# EasyEDA Pro project 基于ESP32智能动植物养护调控系统_2026-06-21.epro, board PCB1
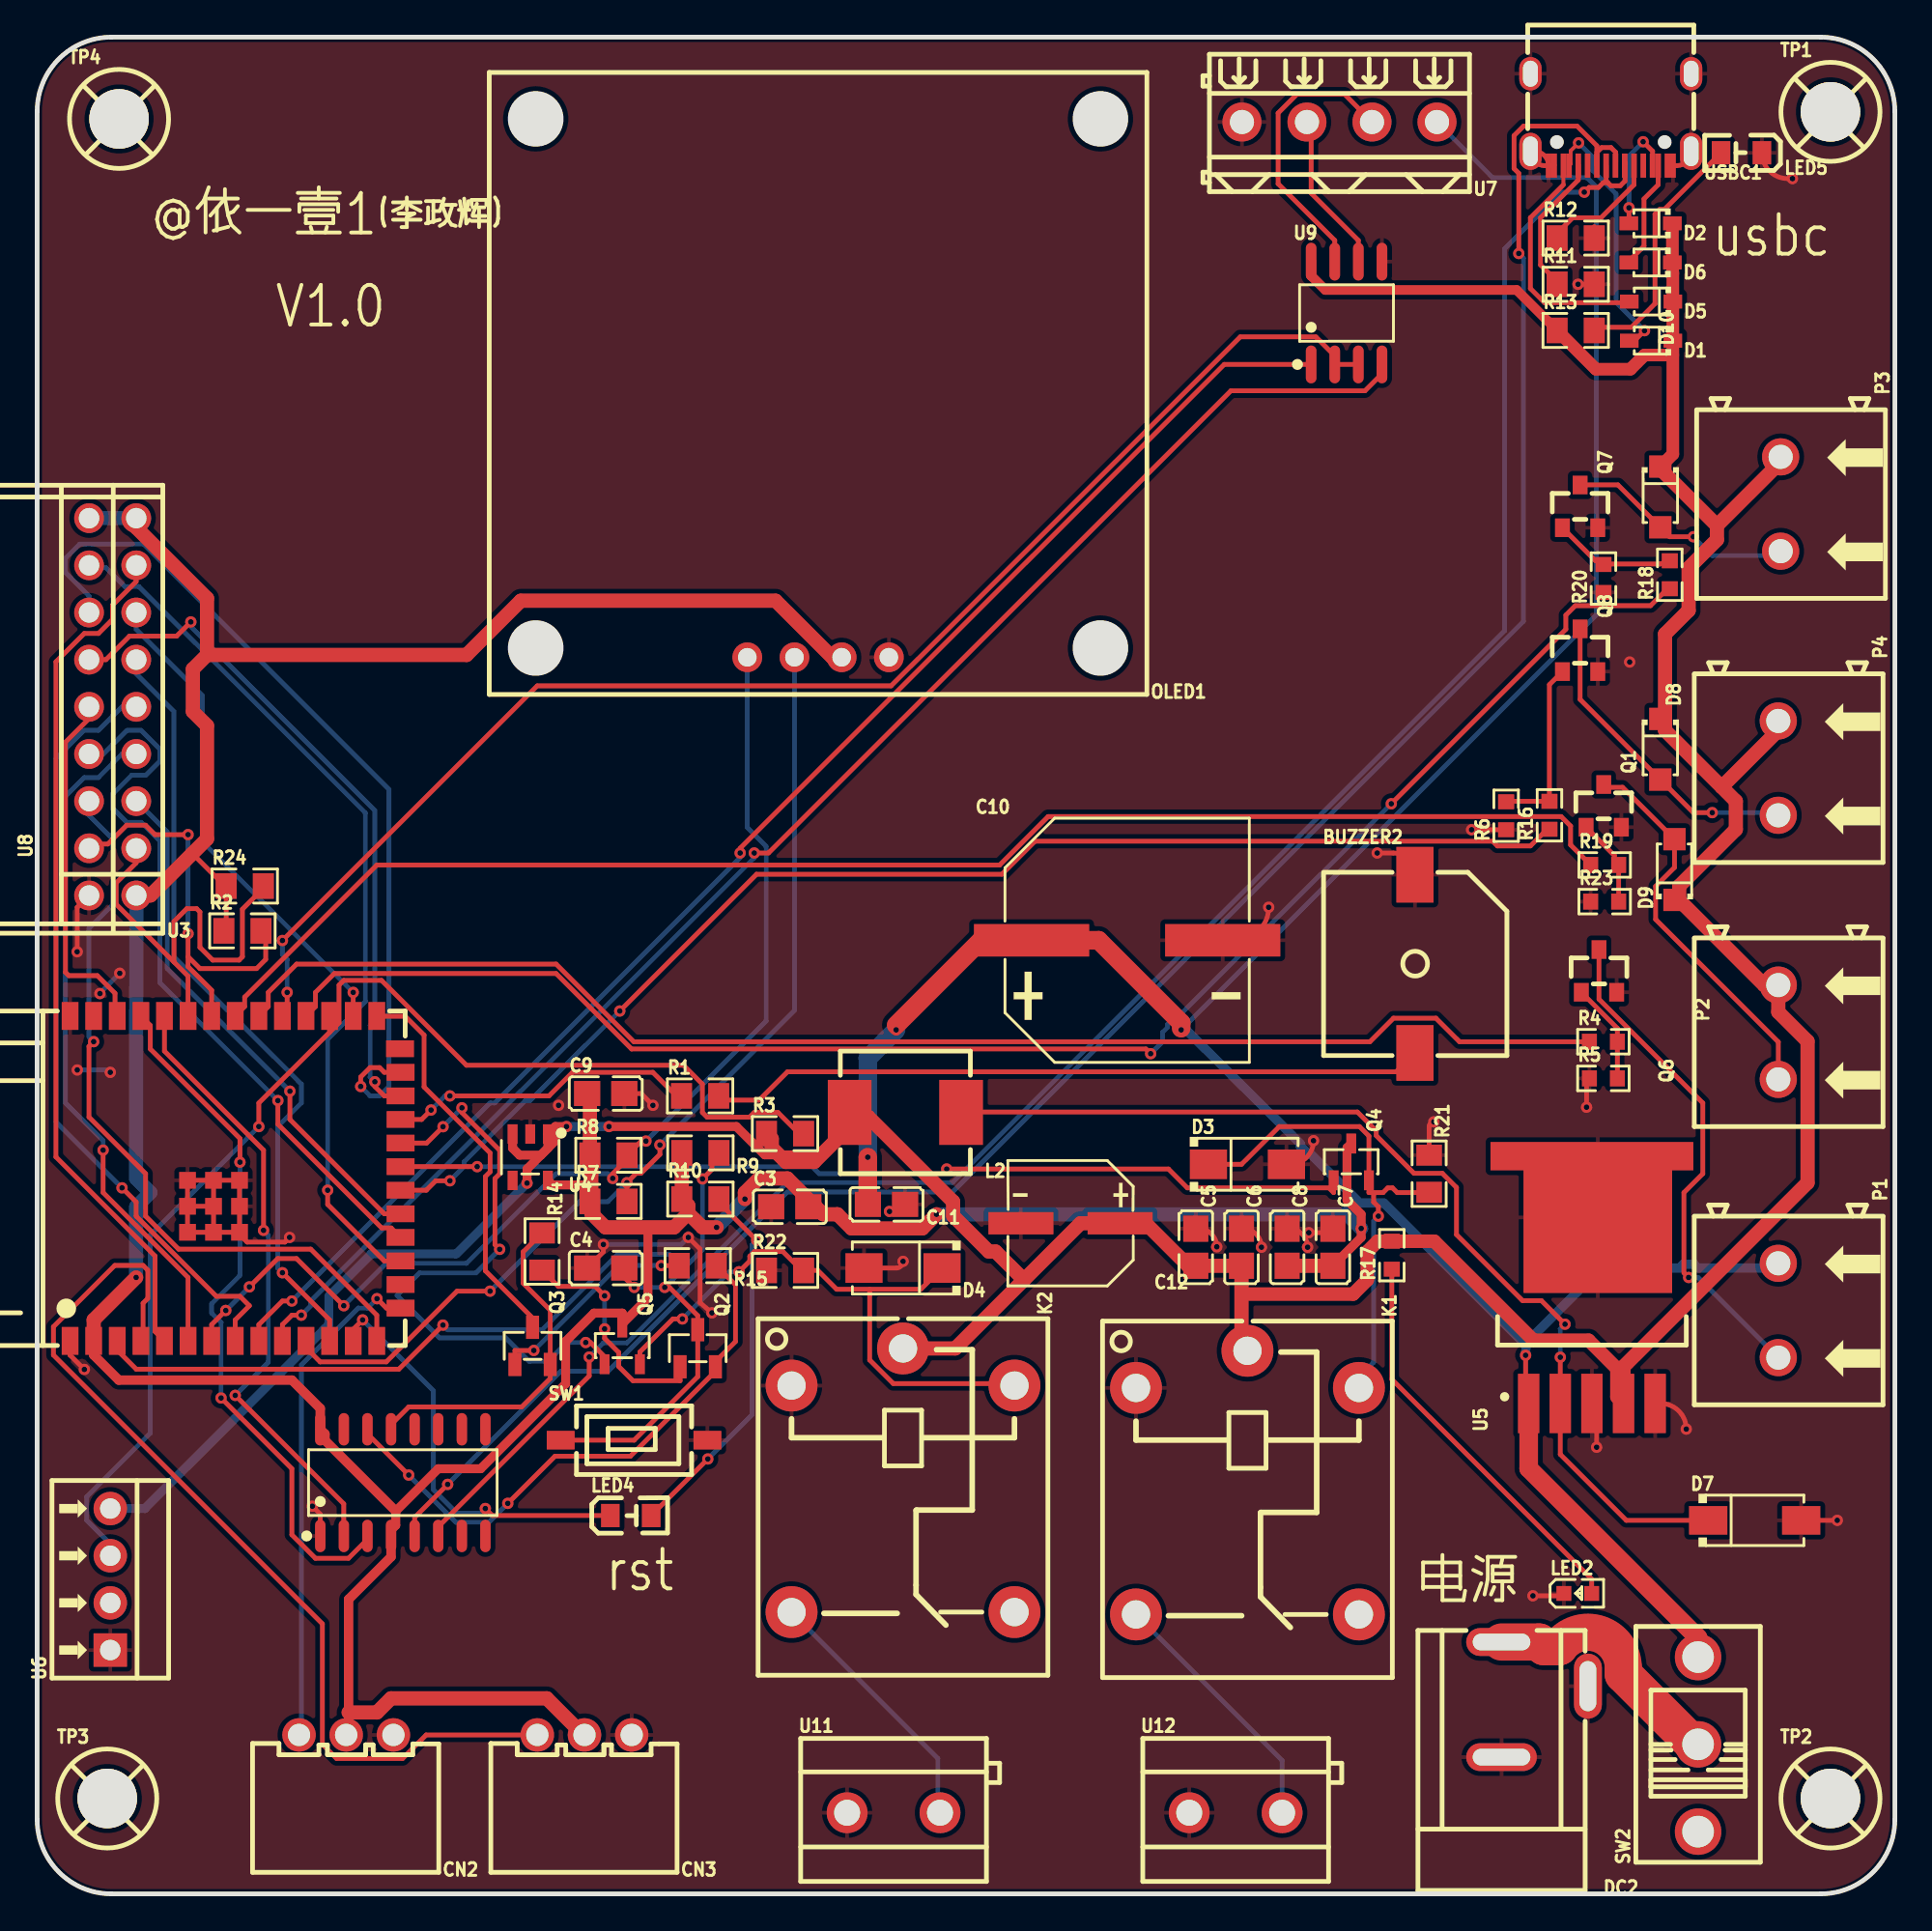
[diagram p1: board, top side]
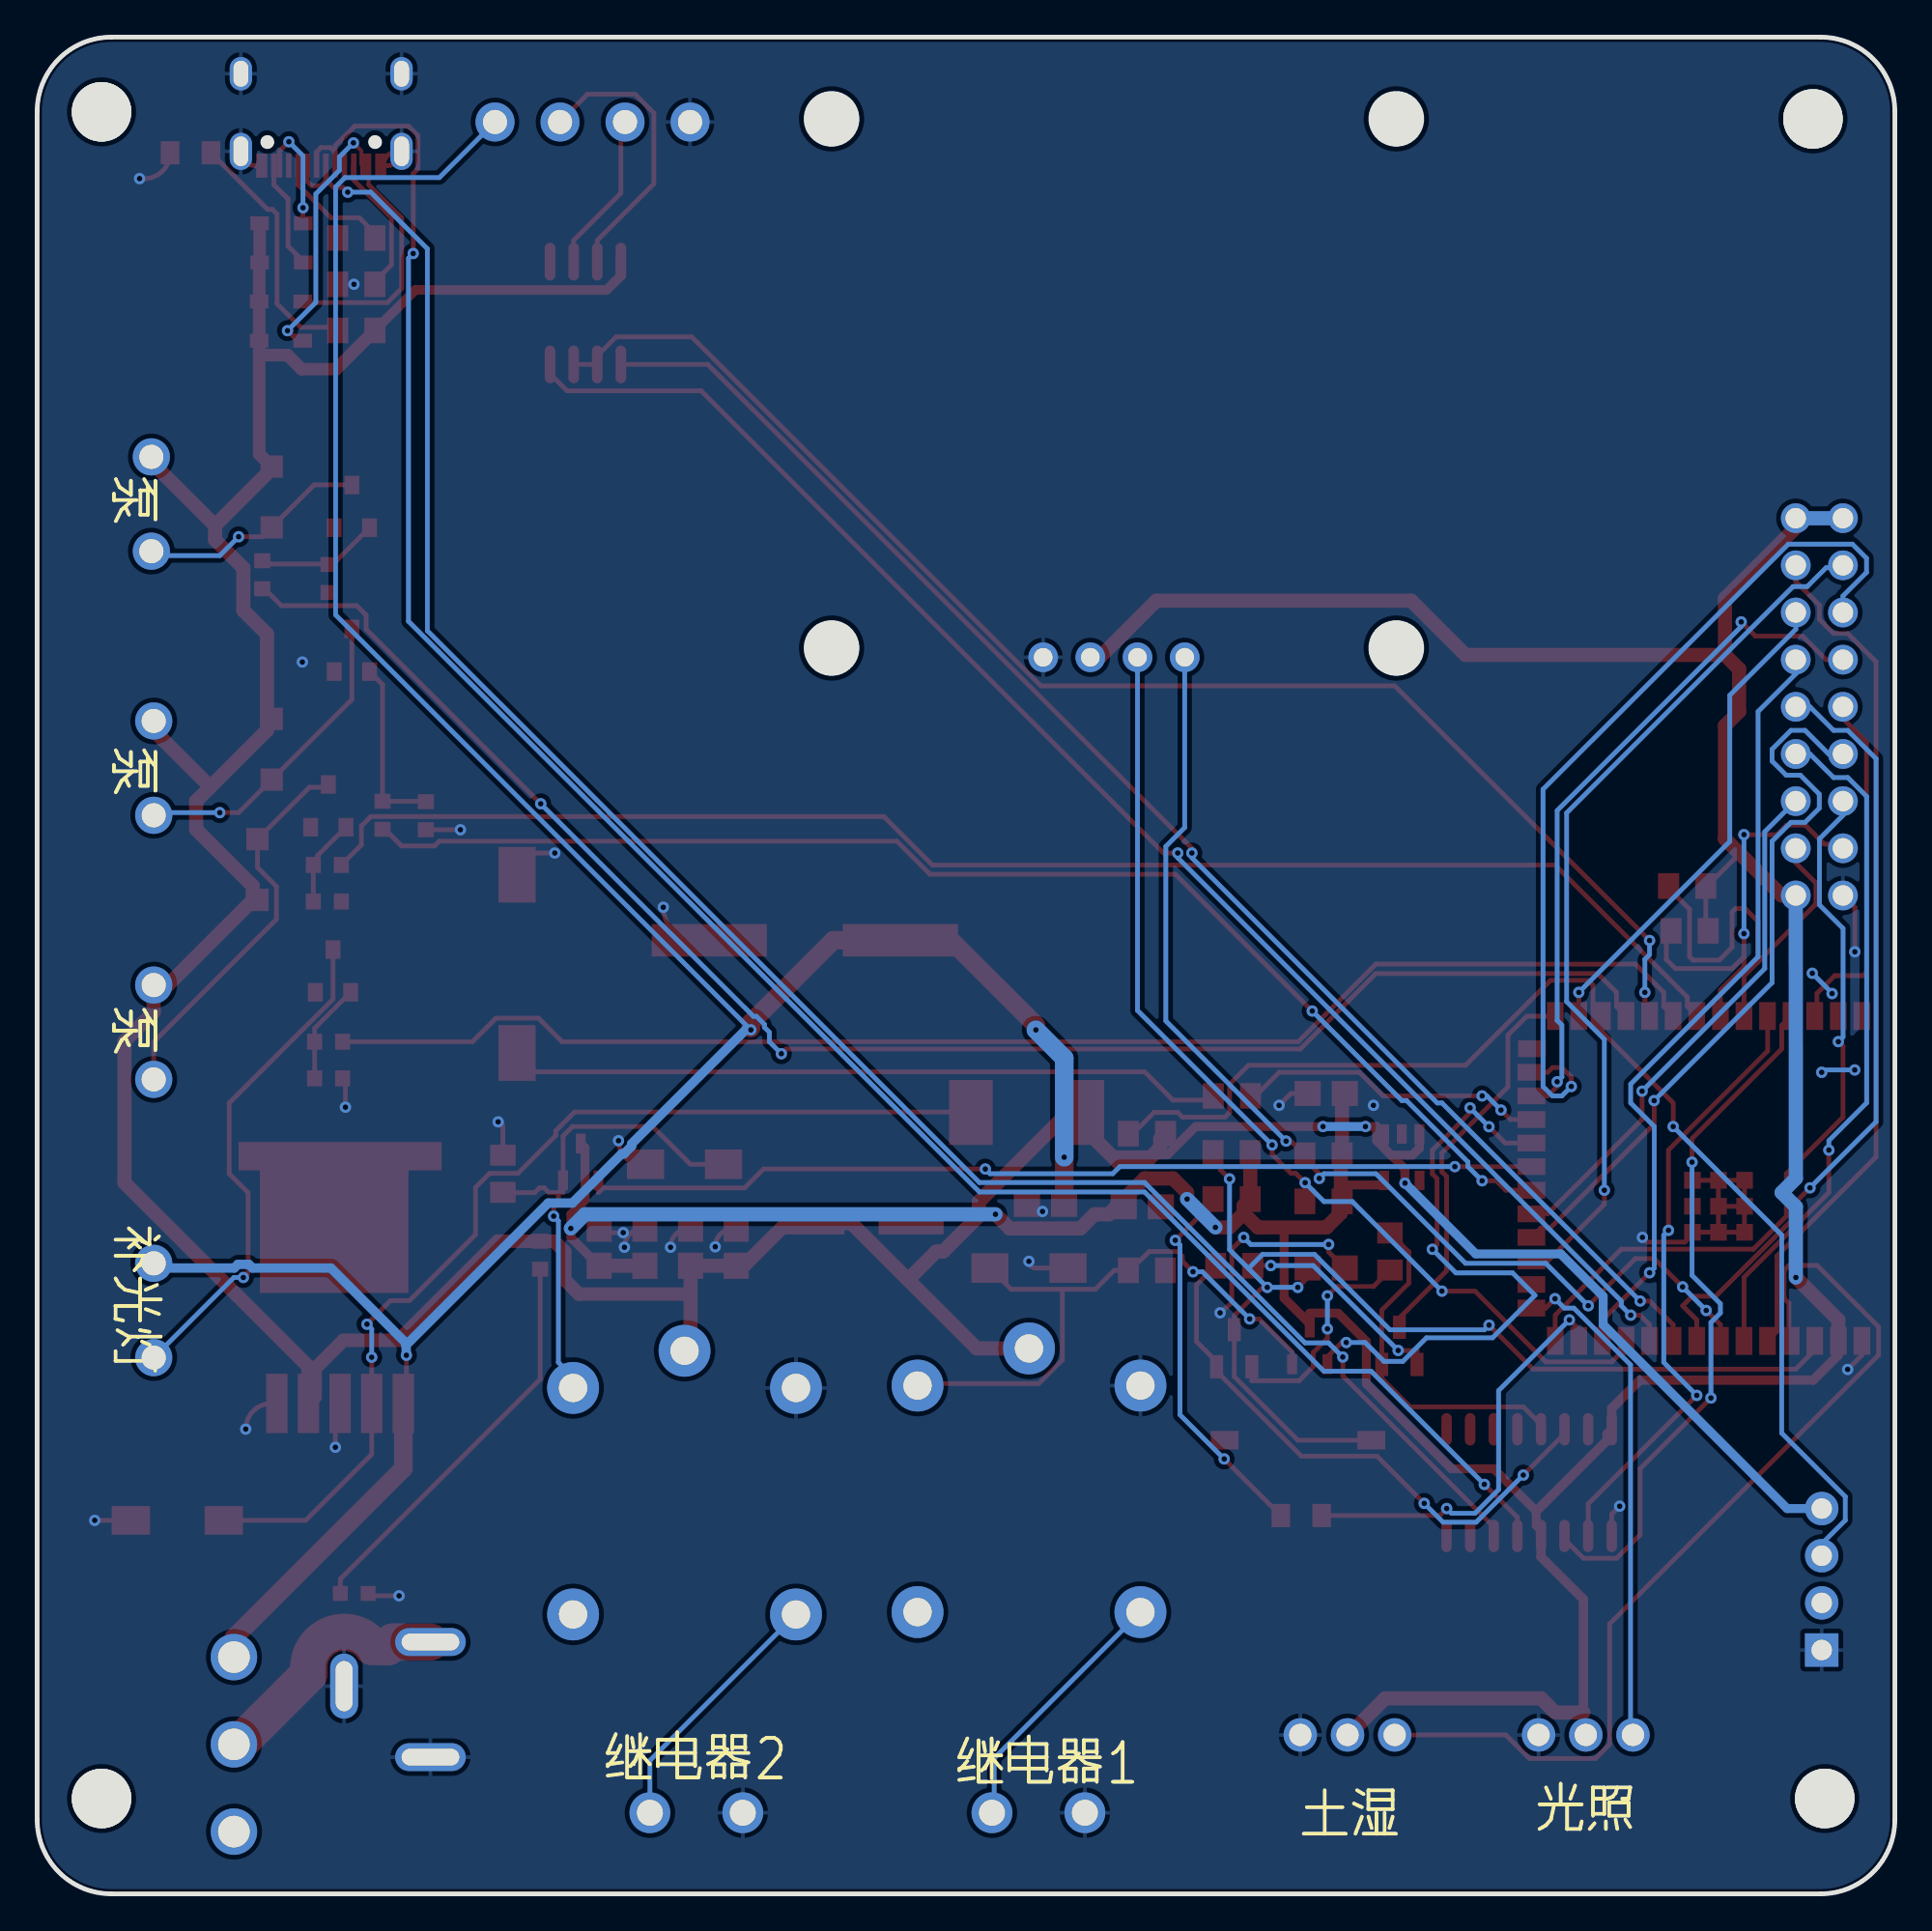
[diagram p2: board, bottom side, seen from below]

Outline 100 x 100 mm; copper layers: Top Layer, Bottom Layer. Coordinates in mm from the lower left corner of the outline.
Outline path: 0,96 0,4 arc(1.17,1.17) 4,0 96,0 arc(98.83,1.17) 100,4 100,96 arc(98.83,98.83) 96,100 4,100 arc(1.17,98.83) 0,96
Stack: Top Layer 0.035mm / Dielectric1 1.51mm FR4 er 4.5 / Bottom Layer 0.035mm

## Design rules (mm)
spacing copperThickness1oz (default): track to track 0.102, other pairs 0.152 to 0.3
spacing copperThickness2oz: track to track 0.203, other pairs 0.152 to 0.3
spacing Plane_innerPlane: track to track 0.102, other pairs 0.152 to 0.3
spacing Copper_copperRegion: track to track 0.102, other pairs 0.152 to 0.3
track width copperThickness1oz (default): min 0.127, default 0.254, max 2.54
track width POWER: min 0.203, default 0.762, max 2.54
differential pair differentialPair (default): width min 0.127, default 0.254, max 2.54; gap min 0.152, default 0.152
net GND uses copperRegion

## Placement (name value [footprint] x y rotation side)
BUZZER2  2.7kHz  [BUZ-SMD_GSD9605YB-3V2800]  74.17 50.09 0 top
C3  100nF  [C0805]  40.51 37.01 0 top
C4  100nF  [C0805]  30.61 33.71 0 top
C5  10uF  [C0805]  62.37 34.83 270 top
C6  100nF  [C0805]  64.83 34.83 270 top
C7  10uF  [C0805]  69.75 34.83 270 top
C8  100nF  [C0805]  67.29 34.83 270 top
C9  100nF  [C0805]  30.61 43.1 0 top
C10  680uF  [CAP-SMD_BD12.5-L13.0-W13.0-FD]  58.67 51.36 0 top
C11  100nF  [C0805]  45.72 37.13 180 top
C12  220uF  [CAP-SMD_BD6.3-L6.6-W6.6-LS7.2-FD]  55.63 36.12 180 top
CN2  XH-3AW  [CONN-TH_3P-P2.54_HCTL_XH-3AW]  16.64 8.56 180 top
CN3  XH-3AW  [CONN-TH_3P-P2.54_HCTL_XH-3AW]  29.46 8.56 180 top
D1  1N5819WS  [SOD-323_L1.8-W1.3-LS2.5-RD]  86.88 83.65 180 top
D2  1N5819WS  [SOD-323_L1.8-W1.3-LS2.5-RD]  86.85 89.97 180 top
D3  1N4007  [SMA_L4.3-W2.5-LS5.0-RD]  65.15 39.29 0 top
D4  1N4007  [SMA_L4.3-W2.5-LS5.0-RD]  46.61 33.71 180 top
D5  1N5819WS  [SOD-323_L1.8-W1.3-LS2.5-RD]  86.88 85.76 180 top
D6  1N5819WS  [SOD-323_L1.8-W1.3-LS2.5-RD]  86.85 87.86 180 top
D7  SS54  [SMA_L4.4-W2.8-LS5.4-R-RD]  92.46 20.12 0 top
D8  1N4001W  [SOD-123FL_L2.7-W1.8-LS3.8-RD]  87.38 61.65 270 top
D9  1N4001W  [SOD-123FL_L2.7-W1.8-LS3.8-RD]  88.14 55.17 90 top
D10  1N4001W  [SOD-123FL_L2.7-W1.8-LS3.8-RD]  87.38 75.23 270 top
DC2  DC-005A-20A  [DC-IN-TH_DC-005A-20A]  81.15 10.46 180 top
K1  SRD-03VDC-SL-C  [RELAY-TH_SRD-XXVDC-XL-C]  65.15 22.15 270 top
K2  SRD-03VDC-SL-C  [RELAY-TH_SRD-XXVDC-XL-C]  46.61 22.28 270 top
L2  33uH  [IND-SMD_L7.3-W6.8]  46.74 42.09 180 top
LED2  NCD0603Y2  [LED0603-RD]  82.93 16.18 0 top
LED4  -  [LED_0805]  32 20.37 0 top
LED5  -  [LED_0805]  91.69 93.78 180 top
OLED1  HS13L03W2C01  [OLED-TH_L35.4-W33.5_HS13L03W2C01]  42.04 66.6 180 top
P1  WJ500V-5.08-2P  [CONN-TH_2P-P5.00_WJ500V-5.08-2P]  93.73 31.42 270 top
P2  WJ500V-5.08-2P  [CONN-TH_2P-P5.00_WJ500V-5.08-2P]  93.73 46.41 270 top
P3  WJ500V-5.08-2P  [CONN-TH_2P-P5.00_WJ500V-5.08-2P]  93.85 74.85 270 top
P4  WJ500V-5.08-2P  [CONN-TH_2P-P5.00_WJ500V-5.08-2P]  93.73 60.63 270 top
Q1  AO3400  [SOT-23_L2.9-W1.3-P1.90-LS2.4-BR]  84.33 58.6 270 top
Q2  SS8050  [SOT-23-3_L2.9-W1.3-P1.90-LS2.4-BR]  35.56 29.39 270 top
Q3  SS8050  [SOT-23-3_L2.9-W1.3-P1.90-LS2.4-BR]  26.67 29.51 270 top
Q4  S8050  [SOT-23-3_L2.9-W1.3-P1.90-LS2.3-BR]  70.74 39.42 270 top
Q5  S8050  [SOT-23-3_L2.9-W1.3-P1.90-LS2.3-BR]  31.5 29.51 270 top
Q6  AO3400  [SOT-23_L2.9-W1.3-P1.90-LS2.4-BR]  84.07 49.71 270 top
Q7  AO3400  [SOT-23_L2.9-W1.3-P1.90-LS2.4-BR]  83.06 74.73 270 top
Q8  AO3400  [SOT-23_L2.9-W1.3-P1.90-LS2.4-BR]  83.06 66.98 270 top
R1  220Ω  [R0805]  35.69 42.98 0 top
R2  4.7kΩ  [R0805]  11.05 51.87 0 top
R3  4K7  [R0805]  40.26 40.94 0 top
R4  1kΩ  [R0603]  84.31 45.89 0 top
R5  10kΩ  [R0603]  84.31 43.92 0 top
R6  10kΩ  [R0603]  79.08 58.07 90 top
R7  4.7kΩ  [R0805]  30.75 37.29 0 top
R8  4.7kΩ  [R0805]  30.75 39.78 0 top
R9  10kΩ  [R0805]  35.7 39.91 180 top
R10  1kΩ  [R0805]  35.7 37.42 0 top
R11  5.1kΩ  [R0805]  82.82 86.69 0 top
R12  5.1kΩ  [R0805]  82.82 89.18 0 top
R13  1kΩ  [R0805]  82.82 84.2 0 top
R14  10kΩ  [R0805]  27.18 34.59 270 top
R15  10kΩ  [R0805]  35.56 33.83 180 top
R16  1kΩ  [R0603]  81.41 58.09 90 top
R17  10K  [R0603]  72.92 34.4 90 top
R18  1kΩ  [R0603]  87.88 71.04 90 top
R19  1kΩ  [R0603]  84.38 55.42 0 top
R20  10kΩ  [R0603]  84.31 70.84 90 top
R21  4.3K  [R0805]  74.93 38.79 270 top
R22  4.3K  [R0805]  40.26 33.58 0 top
R23  10kΩ  [R0603]  84.38 53.44 0 top
R24  4.7kΩ  [R0805]  11.18 54.28 0 top
SW1  -  [Key_SMD_3.6x6.1x2.5]  32.13 24.43 0 top
SW2  SS-12D10L3  [SW-TH_SS-12D10L3]  89.41 8.05 90 top
TP1  -  [M3螺丝]  96.6 95.91 0 top
TP2  -  [M3螺丝]  96.6 5.07 0 top
TP3  -  [M3螺丝]  3.84 5.07 0 top
TP4  -  [M3螺丝]  4.47 95.53 0 top
U1  2.4GHz  [WIRELM-SMD_ESP32-S3-WROOM-1]  10.67 38.53 90 top
U3  OV2640 Camera Board  [SENSORM-TH_L35.7-W3.9-OV2640]  4.06 63.93 180 top
U4  RT9080-33GJ5  [SOT-23-5_L3.0-W1.5-P0.95-LS2.8-BL]  26.54 39.67 180 top
U5  LM2596SX-5.0/NOPB  [TO-263-5_L10.2-W8.9-P1.70-TL]  83.69 31.42 90 top
U6  DB125-2.54-4P-GN-S  [CONN-TH_DB125-2.54-4P-GN]  3.94 16.94 90 top
U7  DB125-3.5-4P-GN-S  [CONN-TH_DB125-3.5-4P-GN]  70.1 95.43 180 top
U8  CH340C  [SOP-16_L10.0-W3.9-P1.27-LS6.0-BL]  19.69 22.15 0 top
U9  MAX485ESA(UMW)  [SOP-8_L5.0-W4.0-P1.27-LS6.0-BL]  70.49 85.14 0 top
U11  KF301-5.0-2P  [CONN-TH_P5.00_KF301-5.0-2P]  46.1 4.37 0 top
U12  KF301-5.0-2P  [CONN-TH_P5.00_KF301-5.0-2P]  64.52 4.37 0 top
USBC1  TYPE-C-31-M-12  [USB-C_SMD-TYPE-C-31-M-12]  84.71 95.55 180 top

## Footprints (pads in the part's own frame, mm; a bottom-side part is the same pattern mirrored in y, then rotated)
BUZ-SMD_GSD9605YB-3V2800
  rect 2x3 smd: 1(0,-4.8) 2(0,4.8)
C0805
  rect 1.41x1.35 smd: 1(-1,0) 2(1,0)
CAP-SMD_BD6.3-L6.6-W6.6-LS7.2-FD
  rect 3.5x1.2 smd: 1(-2.67,0) 2(2.67,0)
CAP-SMD_BD12.5-L13.0-W13.0-FD
  rect 6.2x1.75 smd: 1(-5.145,0) 2(5.145,0)
CONN-TH_2P-P5.00_WJ500V-5.08-2P
  round 2 hole 1.3: 1(-2.54,0) 2(2.54,0)
CONN-TH_3P-P2.54_HCTL_XH-3AW
  round 1.8 hole 1.199: 1(-2.54,0) 2(0.002,0) 3(2.54,0)
CONN-TH_DB125-2.54-4P-GN
  rect 1.8x1.8 hole 1.1: 1(-3.81,0)
  round 1.8 hole 1.1: 2(-1.27,0) 3(1.27,0) 4(3.81,0)
CONN-TH_DB125-3.5-4P-GN
  round 2.1 hole 1.3: 1(-5.25,0) 2(-1.75,0) 3(1.75,0) 4(5.25,0)
CONN-TH_P5.00_KF301-5.0-2P
  round 2.2 hole 1.4: 1(-2.5,0) 2(2.5,0)
DC-IN-TH_DC-005A-20A
  oval 3.8x1.5 hole 3.099x0.9: 1(2.325,-3.1) 2(2.325,3.1)
  oval 1.5x3.5 hole 0.9x2.7: 3(-2.325,-0.722)
IND-SMD_L7.3-W6.8
  rect 2.35x3.5 smd: 1(-3,0) 2(3,0)
Key_SMD_3.6x6.1x2.5
  rect 1.501x1.001 smd: 1(-3.95,0) 2(3.95,0)
LED0603-RD
  rect 0.8x0.8 smd: 1(-0.749,0) 2(0.749,0)
LED_0805
  rect 1x1.25 smd: 1(-1.15,0.005) 2(1.05,0.005)
M3螺丝
  round 3.2 hole 3.2: 1(-0.064,0.064)
OLED-TH_L35.4-W33.5_HS13L03W2C01
  round 1.6 hole 1: 1(-3.81,0) 2(-1.27,0) 3(1.27,0) 4(3.81,0)
R0603
  rect 0.806x0.864 smd: 1(-0.753,0) 2(0.753,0)
R0805
  rect 1.133x1.377 smd: 1(-1,0) 2(1,0)
RELAY-TH_SRD-XXVDC-XL-C
  round 2.794 hole 1.524: 1(-5.1,-6) 2(7.1,-6) 3(7.1,6) 4(-5.1,6) 5(-7.1,0)
SENSORM-TH_L35.7-W3.9-OV2640
  round 1.6 hole 1.1: 1(-1.27,10.16) 2(-1.27,7.62) 3(-1.27,5.08) 4(-1.27,2.54) 5(-1.27,0) 6(-1.27,-2.54) 7(-1.27,-5.08) 8(-1.27,-7.62) 9(-1.27,-10.16) 10(1.27,-10.16) 11(1.27,-7.62) 12(1.27,-5.08) 13(1.27,-2.54) 14(1.27,0) 15(1.27,2.54) 16(1.27,5.08) 17(1.27,7.62) 18(1.27,10.16)
SMA_L4.3-W2.5-LS5.0-RD
  rect 2x1.593 smd: 1(-2.1,0) 2(2.1,0)
SMA_L4.4-W2.8-LS5.4-R-RD
  rect 2.062x1.539 smd: 1(2.503,0) 2(-2.503,0)
SOD-123FL_L2.7-W1.8-LS3.8-RD
  rect 1.2x1.2 smd: 1(-1.635,0) 2(1.635,0)
SOD-323_L1.8-W1.3-LS2.5-RD
  rect 1x0.75 smd: 1(-1.173,0) 2(1.173,0)
SOP-8_L5.0-W4.0-P1.27-LS6.0-BL
  oval 0.574x2.035 smd: 1(-1.905,-2.768) 2(-0.635,-2.768) 3(0.635,-2.768) 4(1.905,-2.768) 5(1.905,2.768) 6(0.635,2.768) 7(-0.635,2.768) 8(-1.905,2.768)
SOP-16_L10.0-W3.9-P1.27-LS6.0-BL
  oval 0.56x1.745 smd: 1(-4.445,-2.873) 2(-3.175,-2.873) 3(-1.905,-2.873) 4(-0.635,-2.873) 5(0.635,-2.873) 6(1.905,-2.873) 7(3.175,-2.873) 8(4.445,-2.873) 9(4.445,2.873) 10(3.175,2.873) 11(1.905,2.873) 12(0.635,2.873) 13(-0.635,2.873) 14(-1.905,2.873) 15(-3.175,2.873) 16(-4.445,2.873)
SOT-23-3_L2.9-W1.3-P1.90-LS2.3-BR
  rect 1.07x0.532 smd: 1(0.99,-0.95) 2(0.99,0.95) 3(-0.99,0)
SOT-23-3_L2.9-W1.3-P1.90-LS2.4-BR
  rect 1.25x0.7 smd: 1(1,-0.95) 2(1,0.95) 3(-1,0)
SOT-23-5_L3.0-W1.5-P0.95-LS2.8-BL
  rect 0.532x1.045 smd: 1(-0.95,-1.25) 2(0,-1.25) 3(0.95,-1.25) 4(0.95,1.25) 5(-0.95,1.25)
SOT-23_L2.9-W1.3-P1.90-LS2.4-BR
  rect 1x0.8 smd: 1(1.15,-0.95) 2(1.15,0.95) 3(-1.15,0)
SW-TH_SS-12D10L3
  round 2.5 hole 1.7: 1(-4.7,0) 2(0,0) 3(4.7,0)
TO-263-5_L10.2-W8.9-P1.70-TL
  rect 3.2x1.15 smd: 1(-5.008,3.404) 2(-5.008,1.702) 3(-5.008,0) 4(-5.008,-1.702) 5(-5.008,-3.404)
  custom 8.128x10.922 smd: 6(5.008,-0.318)
USB-C_SMD-TYPE-C-31-M-12
  oval 1.2x2 hole 0.8x1.6: 0(-4.325,1.706) 1(4.325,1.706)
  oval 1.2x1.8 hole 0.8x1.4: 2(4.325,-2.474) 3(-4.325,-2.474)
  rect 0.3x1.3 smd: A1(-3.35,2.474) A4(-2.55,2.474) A5(-1.25,2.474) A6(-0.25,2.474) A7(0.25,2.474) A8(1.25,2.474) A9(2.55,2.474) A12(3.35,2.474) B1(3.05,2.474) B4(2.25,2.474) B5(1.75,2.474) B6(0.75,2.474) B7(-0.75,2.474) B8(-1.75,2.474) B9(-2.25,2.474) B12(-3.05,2.474)
WIRELM-SMD_ESP32-S3-WROOM-1
  rect 1.5x0.9 smd: 1(-8.75,8.895) 2(-8.75,7.625) 3(-8.75,6.355) 4(-8.75,5.085) 5(-8.75,3.815) 6(-8.75,2.545) 7(-8.75,1.275) 8(-8.75,0.005) 9(-8.75,-1.265) 10(-8.75,-2.535) 11(-8.75,-3.805) 12(-8.75,-5.075) 13(-8.75,-6.345) 14(-8.75,-7.615) 27(8.75,-7.615) 28(8.75,-6.345) 29(8.75,-5.075) 30(8.75,-3.805) 31(8.75,-2.535) 32(8.75,-1.265) 33(8.75,0.005) 34(8.75,1.275) 35(8.75,2.545) 36(8.75,3.815) 37(8.75,5.085) 38(8.75,6.355) 39(8.75,7.625) 40(8.75,8.895)
  rect 0.9x1.5 smd: 15(-6.985,-8.895) 16(-5.715,-8.895) 17(-4.445,-8.895) 18(-3.175,-8.895) 19(-1.905,-8.895) 20(-0.635,-8.895) 21(0.635,-8.895) 22(1.905,-8.895) 23(3.175,-8.895) 24(4.445,-8.895) 25(5.715,-8.895) 26(6.985,-8.865)
  rect 0.9x0.9 smd: 41(-2.9,2.575) 41(-2.9,1.175) 41(-2.9,-0.225) 41(-1.5,2.575) 41(-1.5,1.175) 41(-1.5,-0.225) 41(-0.1,2.575) 41(-0.1,1.175) 41(-0.1,-0.225)

## Nets
As in the schematic.

Pads without a net: K1 3; K2 3; SW2 1; TP1 1; TP2 1; TP3 1; TP4 1; U1 16 26 39; U4 4; U6 2; U8 7 8 9 10 11 12 15; USBC1 A8 B8

## Via types
v1: diameter 0.61, hole 0.305, Top Layer to Bottom Layer, 119 vias

## Routing (per net, layer and track width the routed paths; a pad name or vN(x,y) marks a point on that pad's centre or on a via; arc(x,y) is an arc through that point)
3V3: length 235.8
  Top Layer w0.254: R2.1 10.18,51.99 R24.1 10.1,54.28 8.35,56.03
  Top Layer w0.479: U4.5 27.74,38.18 29.83,38.18 ; 32.88,35.9 32.88,32.09 31.5,30.7 Q5.3 31.5,31.28 29.97,31.28 28.45,29.76 28.45,27.47 23.88,22.9 21.59,22.9 19.3,20.61 19.3,19.85 19.05,19.6 U8.4 ; Q4.3 70.51,40.18 70.51,37.36 71.27,36.6 71.27,35.35 C7.2
  Top Layer w0.504: 19.3,20.61 15.49,24.42 15.49,24.77 U8.16 15.24,26.15 13.72,27.67 4.39,27.67 3.04,29.02 U1.2 ; CN2.2 16.76,8.69 16.76,15.87 19.05,18.15 U8.4
  Top Layer w0.762: U3.1 6.1,53.77 9.14,56.82 9.14,62.92 8.38,63.68 8.38,65.96 9.14,66.73 ; v1(36.57,35.9) 35.81,35.9 35.05,36.66 ; U3.9 5.33,73.58 9.14,69.77 9.14,66.73 ; 35.05,36.66 35.05,37.07 R10.1 R9.2 ; 35.05,36.66 34.29,35.9 30.59,35.9 29.83,36.66 29.83,39.71 R8.1 29.76,42.83 29.61,42.98 C9.1 ; v1(5.33,33.2) 3.04,30.91 U1.2 ; C7.2 C8.2 ; v1(48.41,36.6) 47.65,35.84 43.84,35.84 43.08,36.6 42.32,36.6 41.91,37.01 ; 9.14,66.73 23.11,66.73 26.03,69.65 39.75,69.65 42.8,66.6 OLED1.2 ; 41.91,37.01 C3.2 ; 41.91,37.01 40.38,38.53 38.86,38.53 38.1,37.77 v1(38.1,37.42) ; CN3.2 29.4,8.56 27.43,10.53 19.05,10.53 18.29,9.77 16.76,9.77 ; 29.83,37.42 R7.1
  Bottom Layer w0.762: U3.1 5.33,38.53 6.09,37.77 5.33,37.01 v1(5.33,33.2) ; U3.9 2.79,74.09 ; v1(71.27,35.84) 70.51,36.6 v1(48.41,36.6) ; v1(38.1,37.42) v1(36.57,35.9)
5V: length 239.7
  Top Layer w0.479: v1(26.37,38.28) 26.37,39.04 27.89,40.56 27.89,41.33 ; 27.89,41.33 U4.1 27.49,40.16 27.12,39.79 25.97,39.79 25.59,40.16 U4.3 ; 27.89,41.33 v1(28.5,41.33) ; v1(30.78,41.33) 37.64,41.33 39.16,39.8 42.21,39.8 43.74,41.33
  Top Layer w0.516: U9.8 68.58,87.15 69.34,86.38 79.64,86.38 R13.1
  Top Layer w0.675: D10.1 88.05,77.54 D1.1 D5.1 88.05,87.28 D6.1 D2.1 ; 88.05,82.88 86.53,82.88 85.76,82.11 83.91,82.11 R13.1
  Top Layer w0.726: 64.83,32.3 70.84,32.3 71.6,33.07 71.6,34.59 72.16,35.15 R17.2 75.21,35.15 80.54,29.82 83.52,29.82 85.04,28.29 85.04,26.77 U5.4
  Top Layer w0.762: 88.39,53.52 92.96,48.95 P2.1 93.73,47.49 95.3,45.92 95.3,38.3 85.4,28.39 U5.4 ; 88.39,53.52 D9.1 ; 88.39,53.52 88.39,54.28 91.44,57.33 91.44,58.85 87.63,62.66 87.63,63.03 ; 87.63,63.03 D8.1 ; 87.63,63.03 87.63,67.85 88.9,69.12 88.9,71.41 90.42,72.93 90.42,73.69 ; R3.1 39.55,40.66 39.55,40.18 40.31,39.42 41.83,39.42 43.74,41.33 L2.2 43.97,41.85 44.74,41.85 49.31,37.28 49.31,36.52 51.23,34.59 51.59,34.59 53.12,33.07 ; P4.1 93.73,62.66 90.68,59.61 ; K2.5 49.42,29.38 56.16,36.12 C12.1 59.66,36.12 61.95,33.83 C5.2 C6.2 64.83,30.02 65.15,29.69 K1.5 ; 90.42,73.69 93.85,77.12 P3.1 ; 90.42,73.69 87.38,76.74 D10.1
  Bottom Layer w0.479: v1(26.37,38.28) 22.56,34.47 17.99,34.47 15.7,32.18 15.7,30.66 5.8,20.75 U6.4 ; v1(30.78,41.33) v1(28.5,41.33)
12V: length 156.7
  Top Layer w0.254: v1(46.24,46.53) 46.24,46.79 ; 80.29,26.56 80.12,26.72 v1(80.12,29.01)
  Top Layer w1: 61.58,46.62 61.58,46.91 57.14,51.36 50.81,51.36 46.24,46.79 ; C11.2 44.71,37.39 v1(44.71,39.67) ; SW2.3 89.41,13.79 80.29,22.91 U5.1
  Bottom Layer w0.254: v1(61.58,46.53) 83.93,68.88 83.93,91.93 83.43,92.44 78.35,92.44 U7.1 ; 80.12,29.51 v1(80.12,29.01)
  Bottom Layer w0.5: 80.14,29.55 72.49,37.21 71.19,37.21 68.54,39.86 68.41,39.86 68,40.27 68,40.39 61.86,46.53 v1(61.58,46.53) ; 80.14,29.55 80.14,29.66 84.19,33.71 88.41,33.71 88.61,33.91 89.19,33.91 89.39,33.71 93.33,33.71 93.62,33.97 P1.1 ; 80.14,29.55 80.14,29.53 ; 80.14,29.53 v1(80.12,29.01) ; 80.14,29.53 80.14,29.55
  Bottom Layer w1: v1(46.24,46.53) 44.71,45.01 v1(44.71,39.67)
GND: length 82.2
  Top Layer w0.254: U1.41 U1.41 U1.41 U1.41 ; U1.41 U1.41 ; U1.41 10.89,35.51 11.3,35.1 13.34,35.1 v1(13.59,35.36) ; D4.2 46.25,33.71 arc(46.51,33.81) v1(46.61,34.07) ; U1.1 1.77,29.01 v1(2.54,28.24) ; v1(83.95,24.05) 83.95,26.16 arc(83.87,26.34) U5.3 ; R6.1 v1(77.22,57.31) ; U5.5 87.39,26.41 arc(88.37,26.01) v1(88.77,25.03) ; v1(72.14,56.06) 73,56.06 arc(73.83,55.72) BUZZER2.2 ; C10.2 64.52,51.36 arc(65.77,51.88) v1(66.29,53.14) ; U1.41 U1.41 U1.41 ; U1.41 U1.41 U1.41 ; U1.41 U1.41 ; C4.1 30.48,34.58 v1(30.48,34.98) ; U1.41 U1.41 ; LED2.1 82.06,16.05 v1(80.52,16.05) ; v1(35.05,35.36) 35.69,34.72 35.69,31.84 v1(36.32,31.29) ; v1(94.49,92.38) 94.24,92.38 arc(93.25,92.79) LED5.1 ; U8.1 15.24,20.45 v1(14.81,20.88) ; U1.41 U1.41 ; v1(68.45,35.61) 69.53,35.61 arc(69.68,35.67) C7.1 ; C9.2 32.51,43.1 v1(33.15,42.47) ; 2.79,53.77 2.15,53.13 v1(2.15,50.74) ; v1(96.9,20.12) D7.1 ; C8.1 67.39,35.83 arc(68.1,35.53) v1(68.39,34.83) ; C6.1 64.91,35.83 arc(65.61,35.53) v1(65.91,34.83) ; D3.2 67.44,39.29 arc(68.34,39.67) v1(68.71,40.56) ; R12.2 83.82,89.8 ; USBC1.B1 USBC1.A12 ; USBC1.A12 81.15,93.08 arc(80.61,93.31) USBC1.1 80.59,93.85 arc(81.13,93.62) USBC1.A12 ; v1(83.41,42.37) 83.41,43.77 arc(83.45,43.88) R5.1 ; v1(45.88,36.75) 46.34,36.75 C11.1 ; R21.1 74.93,41.33 arc(75,41.51) v1(75.18,41.58) ; v1(82.95,86.69) R11.2 ; USBC1.A1 88.27,93.08 arc(88.81,93.31) USBC1.0 ; C5.1 62.52,35.83 arc(63.21,35.54) v1(63.5,34.85)
  Bottom Layer w0.254: v1(4.45,49.58) 3.38,48.51 v1(3.38,48.49) ; v1(35.05,35.36) 34.67,34.98 v1(30.48,34.98) ; v1(3.94,44.25) 3.81,44.37 v1(2.16,44.37)
  vias: v1(28.07,42.47) v1(85.72,66.34)
CH340_RX: length 37.8
  Top Layer w0.254: v1(10.92,39.41) 10.92,40.68 6.09,45.5 6.09,46.77 U1.37 ; U8.3 17.78,19.09 16.76,18.07 14.98,18.07 13.71,19.34 13.71,22.9 v1(9.9,26.71)
  Bottom Layer w0.254: v1(10.92,39.41) 10.92,33.31 9.39,31.79 9.39,31.28 9.9,30.77 v1(9.9,26.71)
CH340_TX: length 33.5
  Top Layer w0.254: v1(10.66,26.85) 16.5,21 16.5,19.48 U8.2 ; U1.36 6.85,45.39 12.19,40.05 v1(12.19,35.74)
  Bottom Layer w0.254: v1(10.66,26.85) 12.44,28.62 12.44,35.48 v1(12.19,35.74)
DTR: length 18.7
  Top Layer w0.254: R14.1 26.16,34.58 26.16,32.89 27.62,31.43 Q3.2 27.62,27.76 26.08,26.23 20,26.23 19.05,25.28 U8.13
EN: length 60.3
  Top Layer w0.254: v1(21.84,30.63) 19.47,28.26 5.33,28.26 4.32,29.27 4.32,29.53 U1.3 ; SW1.1 32.14,24.43 35.56,27.86 Q2.3 35.56,31.14 34.04,32.66 v1(33.78,32.66) ; C4.2 31.63,33.43 31.63,33.17 v1(32.14,32.66) ; R9.1 36.58,39.78 36.58,39.52 36.32,39.27 36.32,39.01 v1(35.81,38.51)
  Bottom Layer w0.254: v1(21.84,30.63) 22.1,30.38 27.18,30.38 31.24,34.44 34.04,34.44 34.8,33.68 ; v1(32.14,32.66) v1(33.78,32.66) 35.81,34.7 v1(35.81,38.51)
HREF: length 40.9
  Top Layer w0.254: U1.14 18.28,31.17 14.73,34.72 7.62,34.72 5.84,36.5 5.84,38.79 2.79,41.83 2.79,45.64 v1(3.04,45.9)
  Bottom Layer w0.254: 2.79,58.85 2.79,58.6 2.79,58.09 4.06,56.82 4.06,53.26 2.79,51.99 2.79,46.15 v1(3.04,45.9)
IO0: length 21.3
  Top Layer w0.254: U1.27 18.54,47.27 19.81,47.27 20.83,46.25 20.83,43.46 24.38,39.9 24.38,38.89 24.13,38.63 24.13,33.55 26.67,31.01 Q3.3
IO2: length 19.2
  Top Layer w0.254: U1.38 4.19,47.4 4.19,48.5 3.24,49.45 1.7,49.45 1.52,49.63 1.52,62.03 2.79,63.3 2.79,63.93
IO3: length 27
  Top Layer w0.254: U1.15 18.8,31.55 v1(18.29,32.05)
  Bottom Layer w0.254: v1(18.29,32.05) 17.78,31.55 17.28,31.55 14.23,28.5 14.23,8.69 CN2.3
IO4: length 51.5
  Top Layer w0.254: U1.4 5.7,29.78 5.7,31.81 5.96,32.07 5.96,33.59 5.7,33.85 4.18,33.85 0.88,30.54 0.88,29.02 15.35,14.54 15.35,8.05 16.12,7.29 19.67,7.29 20.94,8.56 26.92,8.56
IO5: length 46.4
  Top Layer w0.254: U3.8 5.33,71.44 5.33,70.68 4.06,69.41 4.06,68.64 3.3,67.88 2.53,67.88 1.01,66.36 1.01,39.69 6.34,34.35 6.34,30.29 U1.5
IO8: length 42.1
  Top Layer w0.254: U1.12 15.74,30.91 v1(13.2,33.45)
  Bottom Layer w0.254: v1(13.2,33.45) 12.95,33.71 12.95,41.33 14.22,42.6 14.22,43.61 7.36,50.47 7.36,63.68 5.33,65.71 5.33,66.22 U3.6
IO9: length 47.5
  Top Layer w0.254: v1(15.64,37.9) 15.64,37.13 18.69,34.09 U1.17
  Bottom Layer w0.254: v1(15.64,37.9) 15.64,46.02 17.67,48.06 17.67,58.22 5.48,70.41 4.72,70.41 3.7,71.42 2.94,71.42 2.79,71.55
IO12: length 70.3
  Top Layer w0.254: U1.20 20.95,37.9 21.46,38.4 v1(22.22,38.4) ; R16.1 81.28,57.34 80.38,56.44 78.61,56.44 78.35,56.69 53.71,56.69 51.94,54.91 38.73,54.91 v1(31.36,47.55)
  Bottom Layer w0.254: v1(31.36,47.55) 26.54,42.72 26.28,42.72 22.98,39.42 22.98,39.17 v1(22.22,38.4)
IO13: length 51.7
  Top Layer w0.254: v1(23.69,39.17) U1.21 ; v1(48.96,39.04) 60.9,39.04 61.91,38.02 69.53,38.02 69.79,37.77 Q4.1
  Bottom Layer w0.254: v1(23.69,39.17) 41.72,39.17 42.1,38.79 48.71,38.79 v1(48.96,39.04)
IO14: length 33.1
  Top Layer w0.254: U1.22 20.97,40.44 v1(21.85,41.32) ; Q5.1 30.55,28.93 29.78,29.69 v1(29.53,29.69) ; v1(22.87,42.33) 22.87,42.08 24.9,40.05 24.9,38.78 24.64,38.52 24.64,34.97 v1(24.9,34.71)
  Bottom Layer w0.254: v1(22.87,42.33) v1(21.85,41.32) ; v1(24.9,34.71) 23.63,33.44 20.58,33.44 19.37,32.23 21.66,29.95 25.21,29.95 26.48,28.68 27.5,28.68 28.51,29.69 v1(29.53,29.69)
IO15: length 42.2
  Top Layer w0.254: v1(4.57,38.02) 5.33,37.26 5.33,36.5 9.65,32.18 10.92,32.18 11.42,31.67 10.66,30.91 U1.8
  Bottom Layer w0.254: U3.5 4.57,63.93 3.3,62.66 2.53,62.66 1.01,61.14 1.01,41.58 v1(4.57,38.02)
IO19: length 22.4
  Top Layer w0.254: LED4.1 24.5,20.38 v1(24.12,20.75) ; v1(17.52,30.91) 17.01,30.4 U1.13
  Bottom Layer w0.254: v1(24.12,20.75) 23.87,20.5 22.6,20.5 21.33,21.77 21.33,27.1 v1(17.52,30.91)
IO21: length 16.7
  Top Layer w0.254: v1(21.2,42.21) 20.69,41.71 U1.23 ; R1.1 34.41,42.98 33.14,44.25 28.82,44.25 27.55,42.98 v1(22.22,42.98)
  Bottom Layer w0.254: v1(21.2,42.21) 21.96,42.98 v1(22.22,42.98)
IO35: length 26.6
  Top Layer w0.254: U1.28 v1(17.01,48.55)
  Bottom Layer w0.254: U3.7 5.33,68.87 5.33,68.11 8.89,64.55 8.89,56.68 v1(17.01,48.55)
IO36: length 67.4
  Top Layer w0.254: 15.74,46.4 16.25,46.91 16.25,48.94 16.5,49.2 18.54,49.2 23.11,44.63 34.79,44.63 35.81,43.61 35.81,42.09 36.06,41.83 38.35,41.83 38.6,42.09 39.87,42.09 40.89,41.07 41.14,41.07 R3.2 ; 15.74,46.4 U1.29 ; 15.74,46.4 11.93,42.59 v1(11.93,41.32)
  Bottom Layer w0.254: v1(11.93,41.32) 6.09,35.48 6.09,24.81 2.67,21.39 2.67,20.12 3.94,18.85 U6.3
IO37: length 87.6
  Top Layer w0.254: v1(72.89,58.71) 82.29,68.11 82.29,68.87 82.8,69.38 86.85,69.38 87.69,70.22 ; U1.30 14.98,47.79 14.98,48.55 16,49.57 27.94,49.57 32,45.5 59.69,45.5 v1(59.94,45.25)
  Bottom Layer w0.254: v1(59.94,45.25) 60.58,45.89 60.58,46.4 60.85,46.67 60.85,46.83 61.28,47.26 61.44,47.26 v1(72.89,58.71)
IO38: length 76.5
  Top Layer w0.254: U1.31 13.46,47.54 v1(13.46,48.55) ; v1(13.2,51.35) 26.92,65.06 45.97,65.06 64.77,83.86 68.83,83.86 69.84,82.84 69.84,82.59 69.85,82.37 U9.3
  Bottom Layer w0.254: v1(13.2,51.35) 13.2,50.58 13.46,50.33 v1(13.46,48.55)
IO39: length 76
  Top Layer w0.254: U1.32 12.44,47.79 12.44,48.55 13.97,50.08 27.94,50.08 32.12,45.89 71.74,45.89 73.01,47.16 75.3,47.16 76.57,45.89 R4.1
IO40: length 79.4
  Top Layer w0.254: U1.33 11.17,47.79 11.17,48.3 18.28,55.41 51.81,55.41 54.42,58.02 82.04,58.02 82.55,57.51 82.55,56.5 R19.1
IO47: length 37.2
  Top Layer w0.254: U1.24 18.69,42.98 18.18,43.48 v1(18.18,43.74) ; v1(8.27,68.5) 7.51,67.74 4.97,67.74 3.7,66.47 2.79,66.47
  Bottom Layer w0.254: v1(18.18,43.74) 17.92,43.99 17.92,46.79 18.18,47.04 18.18,58.34 8.27,68.25 v1(8.27,68.5)
IO48: length 47.6
  Top Layer w0.254: U1.25 18.69,44.25 18.43,44.5 17.92,44.5 17.42,43.99 v1(17.42,43.48)
  Bottom Layer w0.254: v1(17.42,43.48) 17.92,42.98 18.43,42.98 18.94,43.48 18.94,59.49 5.73,72.69 2.29,72.69 1.52,71.93 1.52,71.17 2.79,69.9 2.79,69.01
PCLK: length 36.8
  Top Layer w0.254: U1.6 8.12,33.2 3.55,37.77 v1(3.55,40.06)
  Bottom Layer w0.254: U3.4 4.57,61.39 3.3,60.12 2.53,60.12 1.52,59.11 1.52,42.6 3.55,40.57 v1(3.55,40.06)
RTS: length 30.7
  Top Layer w0.254: v1(20,22.56) 17.78,24.78 U8.14 ; 36.56,28.19 31.94,23.57 27.87,23.57 v1(25.33,21.03) ; R15.1 37.59,32.8 37.59,29.74 36.51,28.66 Q2.2
  Bottom Layer w0.254: v1(25.33,21.03) 24.32,20.02 22.54,20.02 v1(20,22.56)
RXD2: length 79.2
  Top Layer w0.254: v1(37.84,56.06) 37.84,56.31 63.9,82.37 U9.1 ; U1.9 11.93,30.66 13.2,31.93 v1(13.71,31.93)
  Bottom Layer w0.254: v1(13.71,31.93) 24.38,42.6 24.63,42.6 37.84,55.8 v1(37.84,56.06)
SCL: length 55.1
  Top Layer w0.254: R7.2 31.75,37.54 v1(31.75,38.3) 32.25,38.81 32.51,38.81 33.52,39.83 v1(33.52,40.33) ; v1(24.38,32.46) 22.6,32.46 18.79,28.65 15.23,28.65 14.47,29.41 U1.11
  Bottom Layer w0.254: OLED1.3 40.77,47.58 v1(33.52,40.33) ; v1(24.38,32.46) 29.2,37.29 30.73,37.29 v1(31.75,38.3)
SDA: length 60.1
  Top Layer w0.254: v1(32.77,40.54) 32.52,40.54 R8.2 31.75,39.55 30.98,38.79 v1(30.98,38.53) ; v1(11.42,32.69) 12.95,34.21 13.97,34.21 v1(16.5,31.67) ; U1.7 9.39,30.66 v1(10.16,31.42)
  Bottom Layer w0.254: v1(32.77,40.54) 39.24,47.01 39.24,56.41 38.23,57.43 OLED1.4 ; v1(16.5,31.67) 18.79,33.96 23.11,33.96 27.94,38.79 30.73,38.79 v1(30.98,38.53) ; v1(10.16,31.42) v1(11.42,32.69)
SIOC: length 23.8
  Top Layer w0.254: R24.2 12.18,54.16 11.05,53.03 11.05,50.47 10.87,50.29 9.45,50.29 8.76,50.98 8.76,52.88 8.58,53.06 8.05,53.06 7.37,52.37 7.37,50.19 ; U3.2 5.33,56.03 5.33,55.52 4.25,54.45 4.25,53.3 8.12,49.43 U1.35
SIOD: length 22.5
  Top Layer w0.254: U1.34 9.39,48.67 8.12,49.94 8.12,50.47 ; v1(8.12,51.71) 8.12,50.47 ; 8.12,50.47 8.76,49.83 11.81,49.83 12.3,50.33 12.3,51.87 ; v1(8.12,57.05) 6.34,57.05 5.84,57.56 4.82,57.56 3.81,56.54 3.04,56.54 2.79,56.31
  Bottom Layer w0.254: v1(8.12,51.71) v1(8.12,57.05)
TXD2: length 82.1
  Top Layer w0.254: U1.10 13.2,30.66 13.71,31.17 v1(14.22,31.17) ; v1(38.6,56.06) 39.37,56.06 64.26,80.95 71.48,80.95 72.24,81.71 72.24,82.22 U9.4
  Bottom Layer w0.254: v1(38.6,56.06) 38.6,55.8 14.73,31.93 14.73,31.67 v1(14.22,31.17)
USB_D+: length 115.2
  Top Layer w0.254: USBC1.A6 84.97,93.29 84.97,93.8 84.72,94.05 84.21,94.05 83.96,93.8 ; 83.96,93.8 USBC1.B6 ; 83.96,93.8 83.96,94.15 82.9,95.21 80.01,95.21 79.5,94.7 79.5,92.92 79.76,92.67 v1(79.76,88.35) ; v1(22.1,22.05) 20.32,20.28 U8.5
  Bottom Layer w0.254: v1(22.1,22.05) 28.19,28.15 30.73,28.15 40.39,37.8 49.28,37.8 80.01,68.54 80.01,88.09 v1(79.76,88.35)
USB_D-: length 109.5
  Top Layer w0.254: v1(83.28,91.65) 83.54,91.9 84.04,91.9 84.3,92.16 84.55,92.16 84.46,92.25 ; 84.46,92.25 USBC1.A7 ; 84.46,92.25 84.71,92 85.22,92 85.47,92.25 85.47,93.27 USBC1.B7 ; U8.6 21.59,19.77 29.72,27.9 v1(29.72,28.91)
  Bottom Layer w0.254: v1(83.28,91.65) 82.04,91.65 78.99,88.6 78.99,68.03 49.28,38.31 40.39,38.31 31.75,29.67 30.48,29.67 v1(29.72,28.91)
VSYNK: length 28.6
  Top Layer w0.254: U1.19 18.69,36.63 13.61,41.71 v1(13.61,43.23)
  Bottom Layer w0.254: v1(13.61,43.23) 7,49.83 7,57.2 5.48,58.72 U3.3
XCLK: length 39.7
  Top Layer w0.254: v1(12.96,42.72) 12.96,41.45 18.55,35.86 19.06,35.86 U1.18
  Bottom Layer w0.254: v1(12.96,42.72) 6.61,49.07 6.61,56.69 5.59,57.71 4.83,57.71 4.07,58.47 4.07,59.23 5.09,60.25 5.85,60.25 6.61,61.01 6.61,61.65 5.59,62.66 4.83,62.66 3.56,61.39 2.79,61.39
$1N4222: length 12.4
  Top Layer w0.254: v1(30.55,30.43) 30.55,29.92 31.31,29.16 31.31,28.4 32.07,27.64 34.61,27.64 Q2.1 ; v1(30.55,32.21) 30.04,32.72 28.06,32.72 R14.2
  Bottom Layer w0.254: v1(30.55,30.43) v1(30.55,32.21)
$1N4223: length 11.5
  Top Layer w0.254: v1(33.59,33.84) 34.36,33.84 R15.2 ; Q3.1 25.72,29.27 v1(26.74,29.27)
  Bottom Layer w0.254: v1(26.74,29.27) 31.31,33.84 v1(33.59,33.84)
$1N4230: length 13.6
  Top Layer w0.254: 90.64,93.77 87.6,90.72 87.34,90.72 87.09,90.47 87.09,85.64 85.82,84.37 84.04,84.37 R13.2
$1N4298: length 7.6
  Top Layer w0.254: USBC1.B5 82.96,92.3 80.93,90.27 80.93,87.73 81.82,86.84 R11.1
$1N4299: length 6.5
  Top Layer w0.254: USBC1.A5 85.96,92.05 84.18,90.27 82.66,90.27 81.9,89.51 81.9,89.26 R12.1
$1N6304: length 20.2
  Top Layer w0.254: v1(38.73,35.2) 36.7,37.23 R10.2 ; LED4.2 v1(36.1,23.42)
  Bottom Layer w0.254: v1(38.73,35.2) 38.48,34.95 38.48,25.8 v1(36.1,23.42)
$1N16950: length 27.4
  Top Layer w0.254: D3.1 64.83,39.29 66.86,41.33 71.18,41.33 71.69,40.82 Q4.2 71.69,37.77 72.45,37.77 72.71,38.02 72.96,38.02 73.21,37.77 74.74,37.77 R21.2 ; v1(72.2,36.5) 72.2,37.01 71.94,37.26 71.94,37.77
  Bottom Layer w0.254: v1(72.2,36.5) 71.94,36.24 71.94,28.62 70.93,27.61 70.93,27.47 K1.4
$1N17190: length 32.8
  Top Layer w0.254: Q5.2 32.45,29.19 34.22,30.96 v1(34.73,30.96) ; 44.81,32.56 44.81,28.75 46.09,27.48 52.44,27.48 K2.4 ; v1(37.78,33.5) 38.36,34.09 38.36,34.34 38.62,34.59 40.14,34.59 41.16,33.58 R22.2 42.02,33.58 43.04,32.56 47.57,32.56 D4.1
  Bottom Layer w0.254: v1(37.78,33.5) 37.27,33.5 v1(34.73,30.96)
$1N17359: length 13.9
  Bottom Layer w0.254: K1.2 67.02,7.18 U12.2
$1N17369: length 14.2
  Bottom Layer w0.254: K2.2 48.48,7.3 48.48,4.76 48.74,4.51 U11.2
$1N17603: length 38.6
  Top Layer w0.254: R1.2 36.83,43 37.08,42.75 38.86,42.75 40.39,44.27 73.15,44.27 BUZZER2.1
$1N17605: length 6.2
  Top Layer w0.254: D2.2 85.69,90.05 v1(85.69,90.81) ; v1(86.45,94.37) 86.96,93.86 USBC1.B9
  Bottom Layer w0.254: v1(85.69,90.81) 85.69,93.6 v1(86.45,94.37)
$1N17607: length 14
  Top Layer w0.2: v1(82.97,94.3) 82.55,93.88 82.55,93.17 82.54,93.16
  Top Layer w0.254: v1(86.52,84.19) 85.98,83.65 85.7,83.65
  Bottom Layer w0.254: v1(86.52,84.19) 85,85.71 85,91.56 83.73,92.83 83.73,93.55 v1(82.97,94.3)
$1N17610: length 13
  Top Layer w0.2: 82.16,92.05 USBC1.A9
  Top Layer w0.254: 85.7,85.76 85.64,85.7 81.14,85.7 80.38,86.46 80.38,90.27 82.16,92.05
$1N17613: length 5.9
  Top Layer w0.254: USBC1.A4 87.26,92.05 86.5,91.29 86.5,88.75 85.68,87.93 D6.2
$1N17648: length 21.9
  Top Layer w0.254: LED2.2 83.68,16.95 72.92,27.71 R17.1
$1N17654: length 13.9
  Top Layer w2: SW2.2 89.16,8.05 85.38,11.83 85.38,12.19 arc(84.07,14) 81.94,13.31 81.11,13.31 80.85,13.56 DC2.1
$1N17672: length 55.4
  Top Layer w0.254: L2.1 49.99,42.11 71.07,42.11 72.09,41.09 72.09,40.84 74.12,38.81 75.64,38.81 76.4,38.05 76.4,35.51 79.96,31.95 80.97,31.95 v1(82.25,30.68) ; v1(81.99,28.9) U5.2 81.99,23.67 85.54,20.12 D7.2
  Bottom Layer w0.254: v1(81.99,28.9) 81.99,30.43 v1(82.25,30.68)
$1N17696: length 15.4
  Top Layer w0.254: 69.85,87.91 69.85,89.05 66.8,92.1 66.8,95.91 67.82,96.93 70.38,96.93 U7.2
$1N17697: length 8.7
  Top Layer w0.254: U9.6 71.12,89.05 68.58,91.59 68.58,95.15 U7.3
$1N17715: length 27.1
  Top Layer w0.254: Q6.3 84.07,48.18 89.66,42.6 89.66,38.79 88.65,37.77 88.65,33.45 v1(88.9,33.2)
  Bottom Layer w0.254: P1.2 89.41,33.2 v1(88.9,33.2)
$1N17721: length 5.4
  Top Layer w0.254: Q6.1 85.06,46.62 R4.2 R5.2
$1N17723: length 21.1
  Top Layer w0.254: Q1.3 84.58,59.6 85.34,59.6 D9.2 88.14,55.28 87.12,54.26 87.12,52.49 93.73,45.88 P2.2
$1N17724: length 12.5
  Top Layer w0.254: 83.06,75.88 83.31,75.89 85.09,75.89 D10.2 87.88,73.09 v1(89.15,73.09)
  Bottom Layer w0.254: P3.2 93.62,72.08 90.17,72.08 v1(89.15,73.09)
$1N17725: length 17.1
  Top Layer w0.254: v1(90.17,58.23) 89.15,58.23 D8.2 83.06,64.33 Q8.3
  Bottom Layer w0.254: P4.2 93.62,58.09 93.47,58.23 v1(90.17,58.23)
$1N17736: length 4.7
  Top Layer w0.254: Q1.1 84.9,55.92 84.9,55.67 R19.2 R23.2
$1N17738: length 6.4
  Top Layer w0.254: 84.31,71.62 87.36,71.62 87.69,71.72 ; 84.31,71.62 R20.2 ; 84.31,71.62 84.14,71.8 83.89,71.8 Q7.1
$1N17740: length 9.6
  Top Layer w0.254: R6.2 79.12,58.84 R16.2 81.41,65.13 Q8.1

## Copper pours and planes (outline as drawn; the poured copper is in the pictures)
GND on Top Layer: -1.14,102.79 102.74,102.79 102.74,-1.47 -1.14,-1.47
GND on Bottom Layer: -3.68,106.86 102.49,106.86 102.49,-4.27 -3.68,-4.27

## Text on the board
Bottom Silkscreen Layer: 光照 | 土湿 | 继电器1 | 继电器2 | 补光灯 | 泵
Top Silkscreen Layer: V1.0 | rst | usbc | （李政辉） | @依一壹1 | 电源
